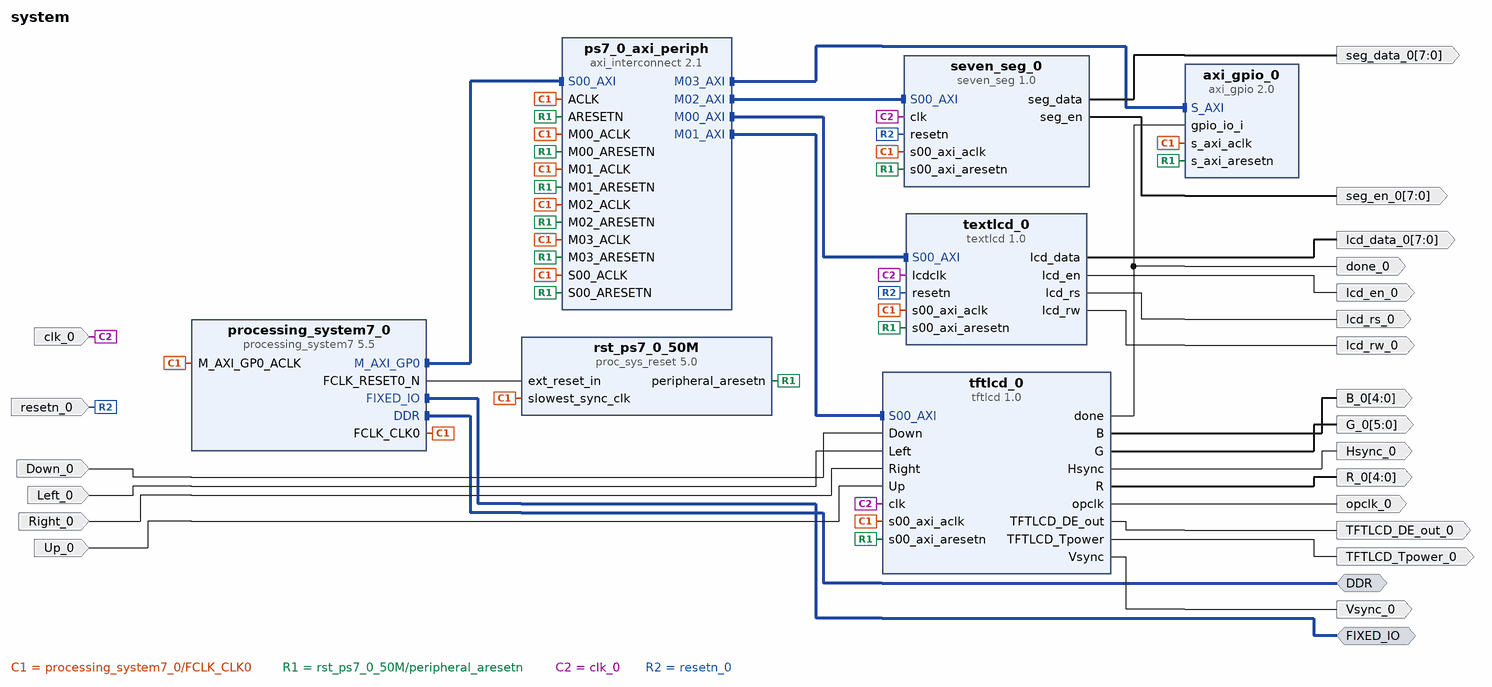
[diagram p0: block diagram of the top level]
# Vivado block design system, xc7z020clg484-1, Vivado 2019.1
create_bd_design system

create_bd_intf_port -mode Master -vlnv xilinx.com:interface:ddrx_rtl:1.0 DDR
create_bd_intf_port -mode Master -vlnv xilinx.com:display_processing_system7:fixedio_rtl:1.0 FIXED_IO
create_bd_port -dir O -from 4 -to 0 B_0
create_bd_port -dir I Down_0
create_bd_port -dir O -from 5 -to 0 G_0
create_bd_port -dir O Hsync_0
create_bd_port -dir I Left_0
create_bd_port -dir O -from 4 -to 0 R_0
create_bd_port -dir I Right_0
create_bd_port -dir O TFTLCD_DE_out_0
create_bd_port -dir O TFTLCD_Tpower_0
create_bd_port -dir I Up_0
create_bd_port -dir O Vsync_0
create_bd_port -dir O done_0
create_bd_port -dir O opclk_0
create_bd_port -dir I -type clk clk_0
create_bd_port -dir I -type rst resetn_0
create_bd_port -dir O -from 7 -to 0 seg_en_0
create_bd_port -dir O -from 7 -to 0 seg_data_0
create_bd_port -dir O -from 7 -to 0 lcd_data_0
create_bd_port -dir O lcd_en_0
create_bd_port -dir O lcd_rs_0
create_bd_port -dir O lcd_rw_0

create_bd_cell -type ip -vlnv xilinx.com:user:textlcd:1.0 textlcd_0
create_bd_cell -type ip -vlnv xilinx.com:user:tftlcd:1.0 tftlcd_0
create_bd_cell -type ip -vlnv xilinx.com:user:seven_seg:1.0 seven_seg_0
create_bd_cell -type ip -vlnv xilinx.com:ip:processing_system7:5.5 processing_system7_0
set_property -dict [list \
  CONFIG.PCW_I2C0_GRP_INT_ENABLE 0 \
  CONFIG.PCW_I2C0_I2C0_IO {MIO 50 .. 51} \
  CONFIG.PCW_I2C0_PERIPHERAL_ENABLE 1 \
  CONFIG.PCW_I2C_PERIPHERAL_FREQMHZ 111.111115 \
  CONFIG.PCW_PRESET_BANK1_VOLTAGE {LVCMOS 1.8V} \
  CONFIG.PCW_SD0_GRP_CD_ENABLE 0 \
  CONFIG.PCW_SD0_GRP_WP_ENABLE 0 \
  CONFIG.PCW_SD0_PERIPHERAL_ENABLE 1 \
  CONFIG.PCW_SD0_SD0_IO {MIO 40 .. 45} \
  CONFIG.PCW_SDIO_PERIPHERAL_FREQMHZ 100 \
  CONFIG.PCW_UART1_PERIPHERAL_ENABLE 1 \
  CONFIG.PCW_UART1_UART1_IO {MIO 48 .. 49} \
  CONFIG.PCW_UART_PERIPHERAL_FREQMHZ 100 \
  CONFIG.PCW_UIPARAM_DDR_PARTNO {MT41J256M16 RE-125} \
] [get_bd_cells processing_system7_0]
# 79 more settings of processing_system7_0 are not shown: defaults, MIO pin electricals, DDR timing, and values the tool derives
create_bd_cell -type ip -vlnv xilinx.com:ip:axi_interconnect:2.1 ps7_0_axi_periph
set_property -dict {CONFIG.NUM_MI 4} [get_bd_cells ps7_0_axi_periph]
create_bd_cell -type ip -vlnv xilinx.com:ip:proc_sys_reset:5.0 rst_ps7_0_50M
create_bd_cell -type ip -vlnv xilinx.com:ip:axi_gpio:2.0 axi_gpio_0
set_property -dict {CONFIG.C_ALL_INPUTS 1 CONFIG.C_GPIO_WIDTH 1} [get_bd_cells axi_gpio_0]

# ---- connections ----

connect_bd_intf_net [get_bd_intf_pins ps7_0_axi_periph/M03_AXI] [get_bd_intf_pins axi_gpio_0/S_AXI]
connect_bd_intf_net [get_bd_intf_ports FIXED_IO] [get_bd_intf_pins processing_system7_0/FIXED_IO]
connect_bd_intf_net [get_bd_intf_pins ps7_0_axi_periph/M00_AXI] [get_bd_intf_pins textlcd_0/S00_AXI]
connect_bd_intf_net [get_bd_intf_pins ps7_0_axi_periph/M01_AXI] [get_bd_intf_pins tftlcd_0/S00_AXI]
connect_bd_intf_net [get_bd_intf_ports DDR] [get_bd_intf_pins processing_system7_0/DDR]
connect_bd_intf_net [get_bd_intf_pins ps7_0_axi_periph/M02_AXI] [get_bd_intf_pins seven_seg_0/S00_AXI]
connect_bd_intf_net [get_bd_intf_pins processing_system7_0/M_AXI_GP0] [get_bd_intf_pins ps7_0_axi_periph/S00_AXI]
connect_bd_net [get_bd_pins processing_system7_0/FCLK_CLK0] \
  [get_bd_pins processing_system7_0/M_AXI_GP0_ACLK] [get_bd_pins ps7_0_axi_periph/S00_ACLK] \
  [get_bd_pins rst_ps7_0_50M/slowest_sync_clk] [get_bd_pins textlcd_0/s00_axi_aclk] [get_bd_pins ps7_0_axi_periph/M00_ACLK] \
  [get_bd_pins ps7_0_axi_periph/ACLK] [get_bd_pins tftlcd_0/s00_axi_aclk] [get_bd_pins ps7_0_axi_periph/M01_ACLK] \
  [get_bd_pins seven_seg_0/s00_axi_aclk] [get_bd_pins ps7_0_axi_periph/M02_ACLK] [get_bd_pins axi_gpio_0/s_axi_aclk] \
  [get_bd_pins ps7_0_axi_periph/M03_ACLK]
connect_bd_net [get_bd_pins processing_system7_0/FCLK_RESET0_N] [get_bd_pins rst_ps7_0_50M/ext_reset_in]
connect_bd_net [get_bd_pins rst_ps7_0_50M/peripheral_aresetn] \
  [get_bd_pins ps7_0_axi_periph/S00_ARESETN] [get_bd_pins textlcd_0/s00_axi_aresetn] \
  [get_bd_pins ps7_0_axi_periph/M00_ARESETN] [get_bd_pins ps7_0_axi_periph/ARESETN] [get_bd_pins tftlcd_0/s00_axi_aresetn] \
  [get_bd_pins ps7_0_axi_periph/M01_ARESETN] [get_bd_pins seven_seg_0/s00_axi_aresetn] \
  [get_bd_pins ps7_0_axi_periph/M02_ARESETN] [get_bd_pins axi_gpio_0/s_axi_aresetn] \
  [get_bd_pins ps7_0_axi_periph/M03_ARESETN]
connect_bd_net [get_bd_pins tftlcd_0/B] [get_bd_ports B_0]
connect_bd_net -net Down_0_1 [get_bd_ports Down_0] [get_bd_pins tftlcd_0/Down]
connect_bd_net [get_bd_pins tftlcd_0/G] [get_bd_ports G_0]
connect_bd_net [get_bd_pins tftlcd_0/Hsync] [get_bd_ports Hsync_0]
connect_bd_net -net Left_0_1 [get_bd_ports Left_0] [get_bd_pins tftlcd_0/Left]
connect_bd_net [get_bd_pins tftlcd_0/R] [get_bd_ports R_0]
connect_bd_net -net Right_0_1 [get_bd_ports Right_0] [get_bd_pins tftlcd_0/Right]
connect_bd_net [get_bd_pins tftlcd_0/TFTLCD_DE_out] [get_bd_ports TFTLCD_DE_out_0]
connect_bd_net [get_bd_pins tftlcd_0/TFTLCD_Tpower] [get_bd_ports TFTLCD_Tpower_0]
connect_bd_net -net Up_0_1 [get_bd_ports Up_0] [get_bd_pins tftlcd_0/Up]
connect_bd_net [get_bd_pins tftlcd_0/Vsync] [get_bd_ports Vsync_0]
connect_bd_net [get_bd_pins tftlcd_0/done] [get_bd_ports done_0] [get_bd_pins axi_gpio_0/gpio_io_i]
connect_bd_net [get_bd_pins tftlcd_0/opclk] [get_bd_ports opclk_0]
connect_bd_net -net clk_0_1 [get_bd_ports clk_0] [get_bd_pins tftlcd_0/clk] [get_bd_pins seven_seg_0/clk] [get_bd_pins textlcd_0/lcdclk]
connect_bd_net -net resetn_0_1 [get_bd_ports resetn_0] [get_bd_pins seven_seg_0/resetn] [get_bd_pins textlcd_0/resetn]
connect_bd_net [get_bd_pins seven_seg_0/seg_en] [get_bd_ports seg_en_0]
connect_bd_net [get_bd_pins seven_seg_0/seg_data] [get_bd_ports seg_data_0]
connect_bd_net [get_bd_pins textlcd_0/lcd_data] [get_bd_ports lcd_data_0]
connect_bd_net [get_bd_pins textlcd_0/lcd_en] [get_bd_ports lcd_en_0]
connect_bd_net [get_bd_pins textlcd_0/lcd_rs] [get_bd_ports lcd_rs_0]
connect_bd_net [get_bd_pins textlcd_0/lcd_rw] [get_bd_ports lcd_rw_0]

# ---- address map ----
assign_bd_address -offset 0x41200000 -range 64K -target_address_space [get_bd_addr_spaces processing_system7_0/Data] [get_bd_addr_segs axi_gpio_0/S_AXI/Reg]
assign_bd_address -offset 0x43C00000 -range 512K -target_address_space [get_bd_addr_spaces processing_system7_0/Data] [get_bd_addr_segs tftlcd_0/S00_AXI/S00_AXI_reg]
assign_bd_address -offset 0x43C80000 -range 64K -target_address_space [get_bd_addr_spaces processing_system7_0/Data] [get_bd_addr_segs textlcd_0/S00_AXI/S00_AXI_reg]
assign_bd_address -offset 0x43C90000 -range 64K -target_address_space [get_bd_addr_spaces processing_system7_0/Data] [get_bd_addr_segs seven_seg_0/S00_AXI/S00_AXI_reg]

validate_bd_design
save_bd_design
